# Altium schematic sheet Control panel.SchDoc
size A4; SheetNumber: 10; SheetTotal: 12
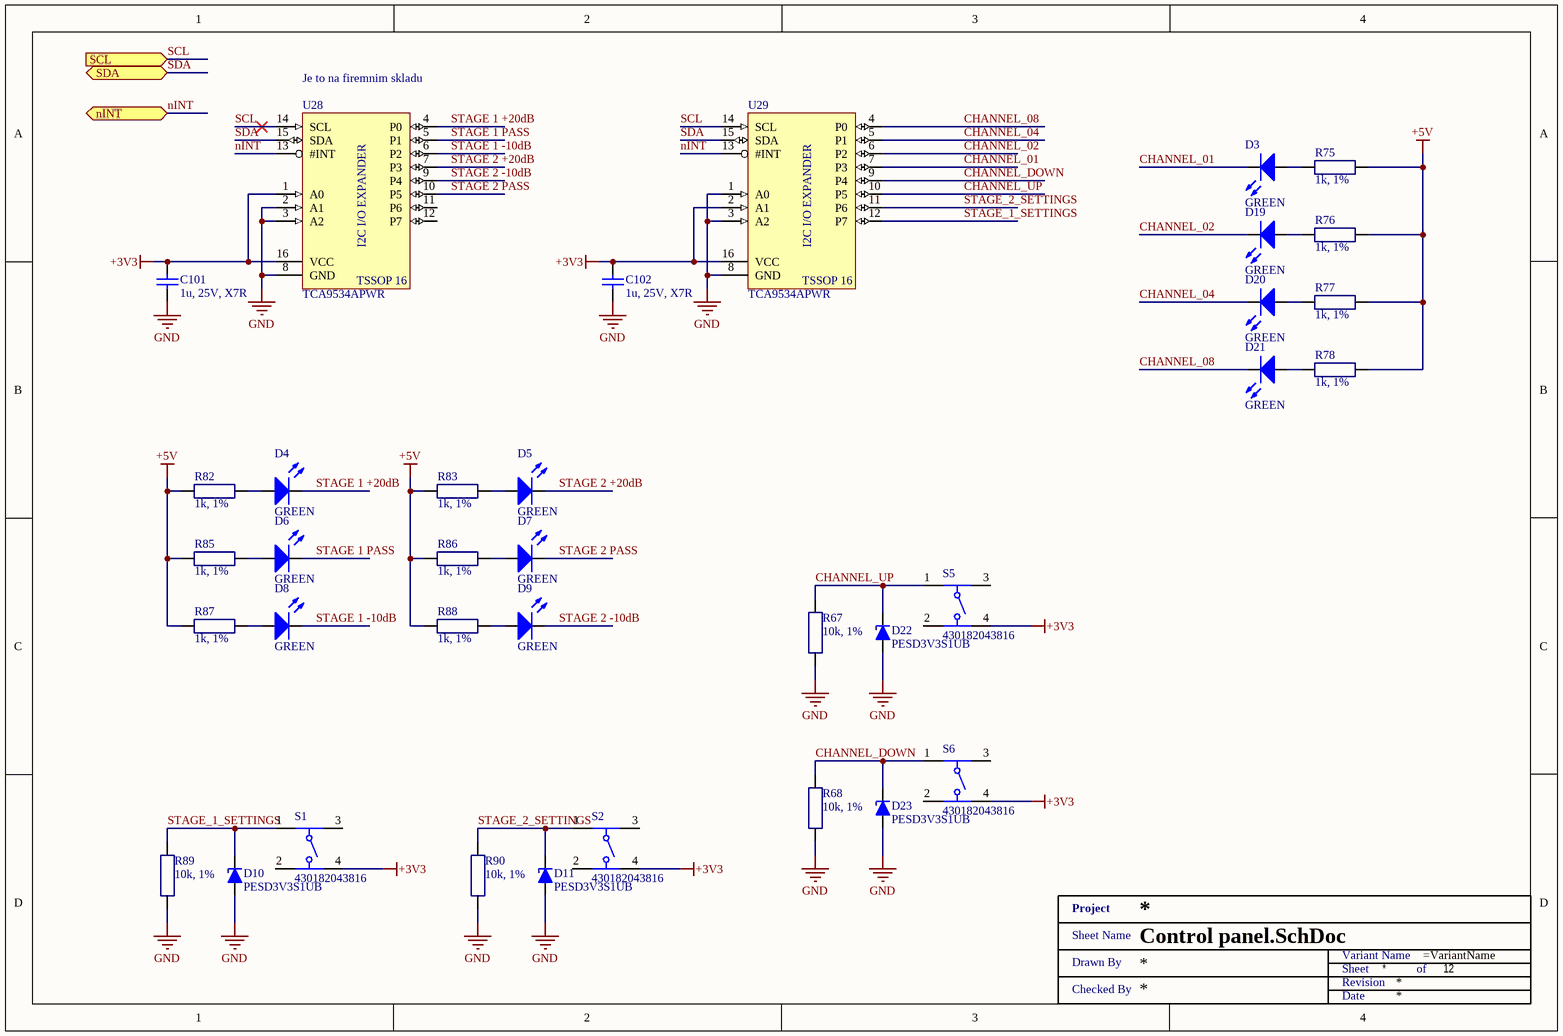
[diagram p0: Control panel.SchDoc]

## Parts
C101  1u, 25V, X7R  [SMD0603]
C102  1u, 25V, X7R  [SMD0603]
D3  GREEN  [MCL-S270]
D4  GREEN  [MCL-S270]
D5  GREEN  [MCL-S270]
D6  GREEN  [MCL-S270]
D7  GREEN  [MCL-S270]
D8  GREEN  [MCL-S270]
D9  GREEN  [MCL-S270]
D10  PESD3V3S1UB  [SOD523]
D11  PESD3V3S1UB  [SOD523]
D19  GREEN  [MCL-S270]
D20  GREEN  [MCL-S270]
D21  GREEN  [MCL-S270]
D22  PESD3V3S1UB  [SOD523]
D23  PESD3V3S1UB  [SOD523]
R67  10k, 1%  [SMD0603 - R]
R68  10k, 1%  [SMD0603 - R]
R75  1k, 1%  [SMD0603 - R]
R76  1k, 1%  [SMD0603 - R]
R77  1k, 1%  [SMD0603 - R]
R78  1k, 1%  [SMD0603 - R]
R82  1k, 1%  [SMD0603 - R]
R83  1k, 1%  [SMD0603 - R]
R85  1k, 1%  [SMD0603 - R]
R86  1k, 1%  [SMD0603 - R]
R87  1k, 1%  [SMD0603 - R]
R88  1k, 1%  [SMD0603 - R]
R89  10k, 1%  [SMD0603 - R]
R90  10k, 1%  [SMD0603 - R]
S1  430182043816  [430182043816]
S2  430182043816  [430182043816]
S5  430182043816  [430182043816]
S6  430182043816  [430182043816]
U28  TCA9534APWR  [TSSOP16N]
U29  TCA9534APWR  [TSSOP16N]
XX?  Title 1  (value not drawn)  (graphical)

## Ports
nINT (bidir), SCL (in), SDA (bidir)

## Nets
+3V3: C101.2 C102.2 S1.4 S2.4 S5.4 S6.4 U28.1(A0) U28.16(VCC) U29.2(A1) U29.16(VCC)
+5V: R75.2 R76.2 R77.2 R78.2 R82.1 R83.1 R85.1 R86.1 R87.1 R88.1
GND: C101.1 C102.1 D10.2(K) D11.2(K) D22.2(K) D23.2(K) R67.2 R68.2 R89.2 R90.2 U28.2(A1) U28.3(A2) U28.8(GND) U29.1(A0) U29.3(A2) U29.8(GND)
CHANNEL_01: D3.2(K) U29.7(P3)
CHANNEL_02: D19.2(K) U29.6(P2)
CHANNEL_04: D20.2(K) U29.5(P1)
CHANNEL_08: D21.2(K) U29.4(P0)
CHANNEL_DOWN: D23.1(A) R68.1 S6.1 U29.9(P4)
CHANNEL_UP: D22.1(A) R67.1 S5.1 U29.10(P5)
nINT: U28.13(#INT) U29.13(#INT) ; port nINT
SCL: U28.14(SCL) U29.14(SCL) ; port SCL
SDA: U28.15(SDA) U29.15(SDA) ; port SDA
STAGE 1 +20dB: D4.2(K) U28.4(P0)
STAGE 1 -10dB: D8.2(K) U28.6(P2)
STAGE 1 PASS: D6.2(K) U28.5(P1)
STAGE 2 +20dB: D5.2(K) U28.7(P3)
STAGE 2 -10dB: D9.2(K) U28.9(P4)
STAGE 2 PASS: D7.2(K) U28.10(P5)
STAGE_1_SETTINGS: D10.1(A) R89.1 S1.1 U29.12(P7)
STAGE_2_SETTINGS: D11.1(A) R90.1 S2.1 U29.11(P6)
NetD3_1: D3.1(A) R75.1
NetD4_1: D4.1(A) R82.2
NetD5_1: D5.1(A) R83.2
NetD6_1: D6.1(A) R85.2
NetD7_1: D7.1(A) R86.2
NetD8_1: D8.1(A) R87.2
NetD9_1: D9.1(A) R88.2
NetD19_1: D19.1(A) R76.1
NetD20_1: D20.1(A) R77.1
NetD21_1: D21.1(A) R78.1

Not connected (* = marked no-connect by the designer): S1 2 3; S2 2 3; S5 2 3; S6 2 3; U28 11(P6) 12(P7)

## Notes on the sheet
- (near U28) Je to na firemnim skladu
- (in symbol TCA9534APWR) I2C I/O EXPANDER; TSSOP 16
- (in symbol Title 1) Project; Sheet Name; Variant Name; Drawn By; Sheet; of; Revision; Checked By; Date

## Library data of the parts
C101 C102 = CGA3E1X7R1E105K080AC: CAP CER 1UF 25V X7R 0603; Manufacturer: TDK Corporation; Tolerance: ±10%; Manufacturer Part Number: CGA3E1X7R1E105K080AC; RoHS: RoHS Compliant; Category: Capacitors; Stock 1: 109509; Pricing 1: 1=0.2, 10=0.135, 100=0.0686, 500=0.04696, 1000=0.04154 (USD); Packaging: Cut Tape (CT); Part Status: Active; Voltage - Rated: 25V; Temperature Coefficient: X7R; Operating Temperature: -55°C ~ 125°C; Features: -; Ratings: AEC-Q200; Applications: Automotive; Failure Rate: -; Mounting Type: Surface Mount, MLCC; Package / Case: 0603 (1608 Metric); Size / Dimension: 0.063" L x 0.032" W (1.60mm x 0.80mm); Height - Seated (Max): -; Thickness (Max): 0.035" (0.90mm); Lead Spacing: -; Lead Style: -; ComponentLink1URL: https://product.tdk.com/info/en/catalog/datasheets/mlcc_automotive_general_en.pdf; ComponentLink1Description: https://product.tdk.com/info/en/catalog/datasheets/mlcc_automotive_general_en.pdf; Capacitance: 1u; Supplier 1: Mouser; Supplier Part Number 1: 810-CGA3E1X7R1E105K; Supplier 2: Farnell; Supplier Part Number 2: 2346962; Supplier 3: Digi-Key; Supplier Part Number 3: 445-6931-1-ND
D3-D9 D19-D21 = MCL-S270GC: MULTICOMP - MCL-S270GC - LED, 0805, GREEN, 10MCD, 570NM; LED Mounting: SMD; Bulb Size: 1.25mm x 1.4; Forward Current If: 20; Forward Voltage: 2.1; Wavelength Typ: 570; Luminous Intensity: 10; Viewing Angle: 140°; Lens Shape: Rectangular; SVHC: No SVHC (17-Dec-2015); Forward Voltage VF Max: 2.6; LED / Lamp Size: 1.4mm x 1.25; LED Type: Standard; Luminous Intensity Max: 16; Luminous Intensity Min: 4.5; No. of Pins: 2; Peak Forward Current: 100; Peak Wavelength: 568; Reverse Protection Voltage: 5; Voltage Vf Min: 1.7; Voltage Vf Typ: 2.1V<!--FANDB--><div class="features-and-benefits-container"><div class="features-and-benefits-description"><span class="features-benefits-value">The MCL-S270GC is a green SMD LED made of GaP dice. This LED offers water clear rectangular lens and 260°C for 5 seconds lead soldering temperature range 1.6mm from body.</span></div><div class="features-and-benefits-list"><ul class="features-and-benefits-list-list"><li class="features-and-benefits-list-item">-40 to 85; Manufacturer: MULTICOMP; Manufacturer Part Number: MCL-S270GC; RoHS: YES; Stock 1: 80989; Pricing 1: 5=0,145, 25=0,136, 100=0,126, 250=0,0813, 500=0,0645, 2000=0,0559, 5000=0,0496, 20000=0,0434 (GBP); LED Colour: Green; Packaging: Cut Tape; Product Range: -; Automotive Qualification Standard: -; MSL: MSL 3 - 168 hours; Current Rating: 20; Dominant Wavelength: 570; Dominant Wavelength Typ: 570; Forward Current If Max: 20; Luminous Intensity Typ: 10; Operating Temperature Max: 85; Operating Temperature Min: -40; Operating Temperature Range: -40°C to +85; Storage Temperature Max: +100; Storage Temperature Min: -40; ComponentLink1URL: http://www.farnell.com/cad/53028.pdf; ComponentLink1Description: http://www.farnell.com/cad/53028.pdf; ComponentLink2URL: http://www.farnell.com/datasheets/1671537.pdf; ComponentLink2Description: http://www.farnell.com/datasheets/1671537.pdf; Supplier 1: Farnell; Supplier Part Number 1: 1581242; Supplier 2: Newark; Supplier Part Number 2: 14N9356
D10 D11 D22 D23 = PESD3V3S1UB,115: TVS DIODE 3.3V 20V SOD523; Manufacturer: Nexperia USA Inc.; Type: Zener; Voltage - Reverse Standoff (Typ): 3.3V (Max); Voltage - Breakdown (Min): 5.2V; Current - Peak Pulse (10/1000µs): 18A (8/20µs); Power - Peak Pulse: 330W; Power Line Protection: No; Capacitance @ Frequency: 207pF @ 1MHz; Manufacturer Part Number: PESD3V3S1UB,115; RoHS: RoHS Compliant; Category: Circuit Protection; Stock 1: 0; Pricing 1: 1=0.49, 10=0.368, 100=0.2082, 500=0.1379, 1000=0.10573 (USD); Packaging: Cut Tape (CT); Part Status: Active; Voltage - Clamping (Max) @ Ipp: 20V; Applications: General Purpose; Operating Temperature: -65°C ~ 150°C (TA); Mounting Type: Surface Mount; Package / Case: SC-79, SOD-523; Supplier Device Package: SOD-523; Base Part Number: PESD*S1U; ComponentLink1URL: https://assets.nexperia.com/documents/data-sheet/PESDXS1UB_SERIES.pdf; ComponentLink1Description: https://assets.nexperia.com/documents/data-sheet/PESDXS1UB_SERIES.pdf; Supplier 1: Mouser; Supplier Part Number 1: 771-PESD3V3S1UB-T/R; Supplier 2: Farnell; Supplier Part Number 2: 8737568; Supplier 3: Digi-Key; Supplier Part Number 3: 1727-3829-1-ND; Supplier 4: TME; Supplier Part Number 4: PESD3V3S1UB.115
R67 R68 R89 R90 = RC0603FR-0710KL: YAGEO (PHYCOMP) - RC0603FR-0710KL - RES, THICK FILM, 10K, 1%, 0.1W, 0603; Voltage Rating: 50; Resistor Case Style: 0603 [1608 Metric]; Power Rating: 100; Product Range: RC Series; Temperature Coefficient: ± 100; SVHC: No SVHC (20-Jun-2016); Manufacturer: YAGEO (PHYCOMP); Manufacturer Part Number: RC0603FR-0710KL; RoHS: YES; Stock 1: 9995; Pricing 1: 5000=0.0025, 25000=0.0014, 50000=0.0013 (GBP); Resistance: 10k; Resistance Tolerance: ± 1%; Packaging: Tape & Reel; Resistor Element Material: Thick Film; Automotive Qualification Standard: -; MSL: MSL 1 - Unlimited<!--FANDB--><div class="features-and-benefits-container"><div class="features-and-benefits-desc-container"><span class="features-and-benefits-container-desc">SMD Chip Resistor, Thick Film, 10 kohm, 50 V, 0603 [1608 Metric], 100 mW, ± 1; ComponentLink1URL: http://past.yageo.com/pdf/PYu-R_Packing_6.pdf; ComponentLink1Description: http://past.yageo.com/pdf/PYu-R_Packing_6.pdf; ComponentLink2URL: http://www.farnell.com/datasheets/2167052.pdf; ComponentLink2Description: http://www.farnell.com/datasheets/2167052.pdf; Supplier 1: Mouser; Supplier Part Number 1: 603-RC0603FR-0710KL; Supplier 2: Farnell; Supplier Part Number 2: 2421850; Supplier 3: Digi-Key; Supplier Part Number 3: 311-10.0KHRCT-ND
R75-R78 R82 R83 R85-R88 = MCWR06X1001FTL: MULTICOMP - MCWR06X1001FTL - RES, THICK FILM, 1K, 1%, 0.1W, 0603; Voltage Rating: 50; Resistor Case Style: 0603 [1608 Metric]; Power Rating: 100; Product Range: MCWR Series; Temperature Coefficient: ± 100; SVHC: No SVHC (07-Jul-2017)<!--FANDB--><div class="features-and-benefits-container"><div class="features-and-benefits-desc-container"><span class="features-and-benefits-container-desc">SMD Chip Resistor, Thick Film, 1 kohm, 50 V, 0603 [1608 Metric], 100 mW, ± 1; Manufacturer: MULTICOMP; Manufacturer Part Number: MCWR06X1001FTL; RoHS: Y-EX; Stock 1: 134740; Pricing 1: 10=0.0037, 100=0.0022, 500=0.0016, 1000=0.0012, 2500=0.001 (GBP); Resistance: 1k; Resistance Tolerance: ± 1%; Packaging: Cut Tape; Resistor Element Material: Thick Film; Automotive Qualification Standard: -; ComponentLink1URL: http://www.farnell.com/datasheets/1849611.pdf; ComponentLink1Description: http://www.farnell.com/datasheets/1849611.pdf; Supplier 1: Farnell; Supplier Part Number 1: 2447272; Supplier 2: Newark; Supplier Part Number 2: 94X1378
S1 S2 S5 S6 = 430182043816: WS-TASV SMT Tact Switch, 6x6x4.3mm, 160gf; Manufacturer: Wurth Elektronik; Rated Voltage: 12VDC; Rated Current: 50mA; Washable: No; ComponentLink1Description: Manufacturer; ComponentLink1URL: http://www.we-online.de; ComponentLink2Description: Datasheet; ComponentLink2URL: https://www.we-online.com/catalog/datasheet/430182043816.pdf; Operating Temperature: -40 to +85degC; Manufacturer Part Number: 430182043816; Published Date: November 2020; Contact Material: Stainless Steel; Size: 6x6x4.3mm; Mounting Technology: SMT; Contact Plating: Silver; Operation Force: 160gf; Packaging: Tape and Reel; Terminal Material: Copper Alloy; Terminal Plating: Silver; Supplier 1: Mouser; Supplier Part Number 1: 710-430182043816; Supplier 2: Farnell; Supplier Part Number 2: 2065105; Supplier 3: RSComponents; Supplier Part Number 3: 7856260
U28 U29 = TCA9534APWR: IC I/O EXPANDER I2C 8B 16TSSOP; Manufacturer: Texas Instruments; Number of I/Os: 8; Frequency: 400kHz; Supplier 1: Mouser; Supplier Part Number 1: 595-TCA9534APWR; Manufacturer Part Number: TCA9534APWR; Stock 1: 3614; Pricing 1: 1 = 1.25000, 10 = 1.07000, 50 = 1.07000, 100 = 0.81500, 500 = 0.72100, 1000 = 0.56900, 2000 = 0.50500, 10000 = 0.48600, 24000 = 0.47000, 50000 = 0.45500 (USD); RoHS: Yes; Mount: Surface Mount; Case/Package: TSSOP; Number of Pins: 16; Contact Plating: Gold; Min Operating Temperature: -40°C; Max Operating Temperature: 85°C; Packaging: Tape and Reel; Interface: I2C; Number of Outputs: 8; Lead Free: Lead Free; ComponentLink1URL: http://www.ti.com/general/docs/lit/getliterature.tsp?genericPartNumber=TCA9534A&&fileType=pdf&src-supplier=Avnet; ComponentLink1Description: http://www.ti.com/general/docs/lit/getliterature.tsp?genericPartNumber=TCA9534A&&fileType=pdf&src-supplier=Avnet; ComponentLink2URL: http://www.ti.com/lit/ds/symlink/tca9534a.pdf?src-supplier=Digi-Key; ComponentLink2Description: http://www.ti.com/lit/ds/symlink/tca9534a.pdf?src-supplier=Digi-Key; ComponentLink3URL: http://www.ti.com/general/docs/lit/getliterature.tsp?genericPartNumber=TCA9534A&&fileType=pdf&src-supplier=Avnet+Asia; ComponentLink3Description: http://www.ti.com/general/docs/lit/getliterature.tsp?genericPartNumber=TCA9534A&&fileType=pdf&src-supplier=Avnet+Asia; ComponentLink4URL: http://www.ti.com/lit/pdf/sszc003?src-supplier=Digi-Key; ComponentLink4Description: http://www.ti.com/lit/pdf/sszc003?src-supplier=Digi-Key; Supplier 2: Digi-Key; Supplier Part Number 2: 296-40573-1-ND; Supplier 3: Arrow; Supplier Part Number 3: TCA9534APWR